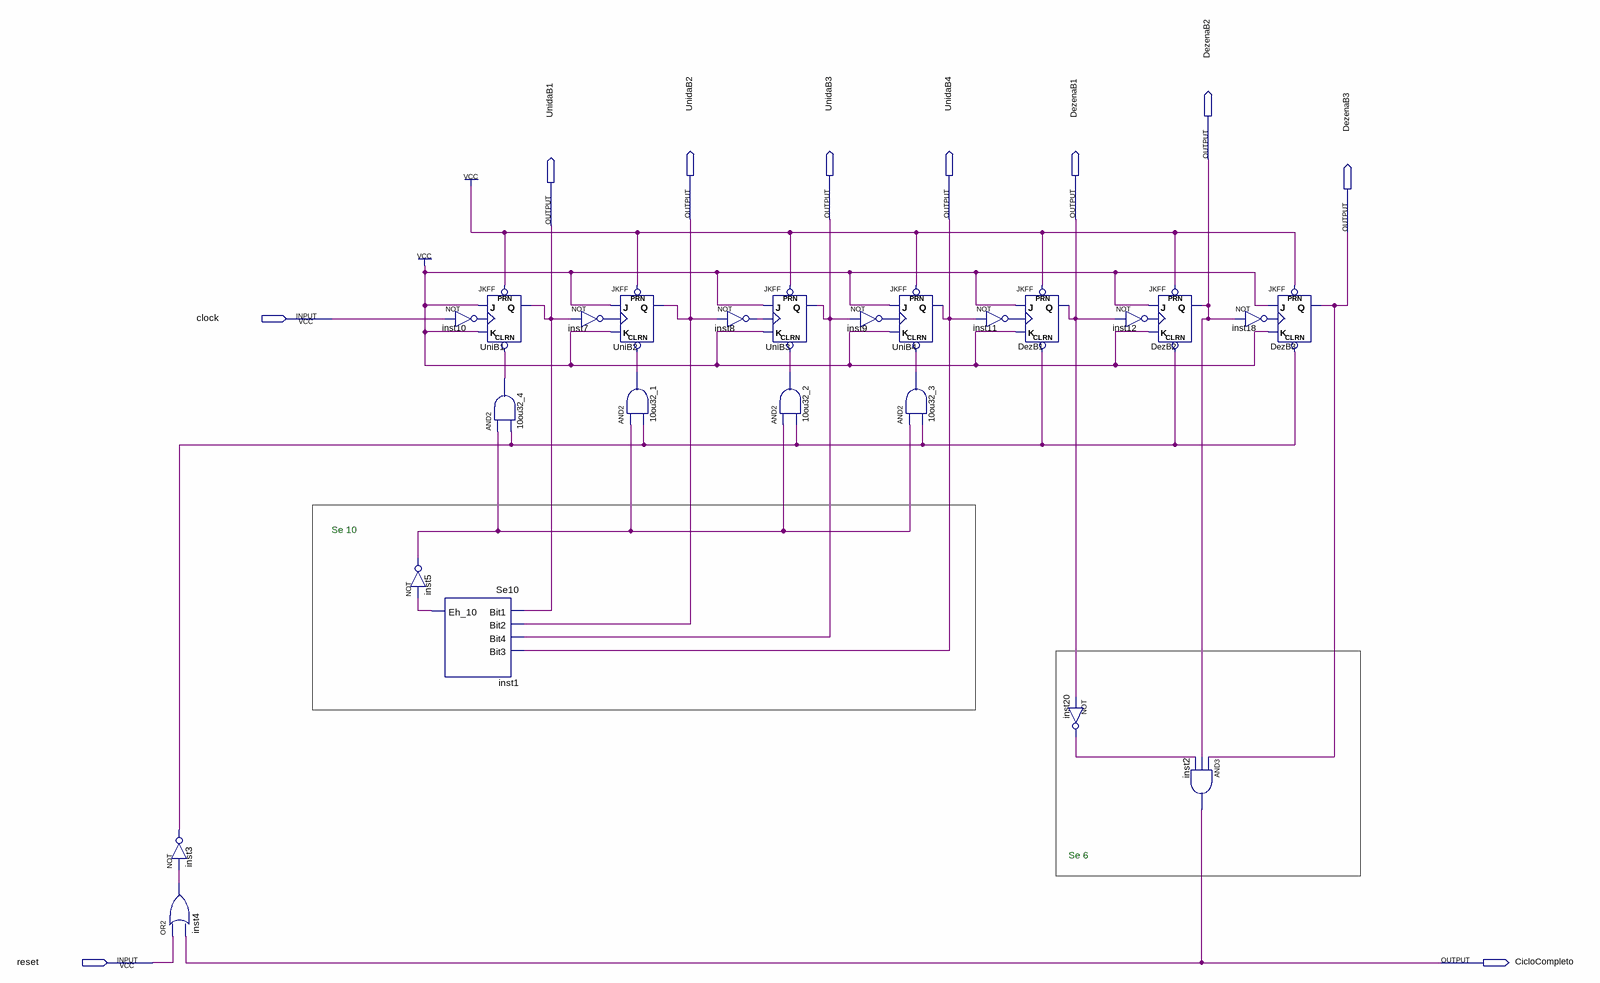
[diagram p0: schematic sheet]
// Quartus schematic Contador59.bdf as structural Verilog: 24 symbols, 10 pins
module Contador59 (
  input  clock,
  input  reset,
  output DezenaB2,
  output UnidaB2,
  output UnidaB3,
  output UnidaB4,
  output DezenaB1,
  output UnidaB1,
  output DezenaB3,
  output CicloCompleto
);

  wire inst1_eh_10, inst3_out, inst4_out, inst5_out, inst7_out, inst8_out, inst9_out, inst11_out, inst18_out,
       inst20_out, n10ou32_1_out, n10ou32_2_out, n10ou32_3_out, n10ou32_4_out;

  or inst4 (inst4_out, reset, CicloCompleto);
  not inst3 (inst3_out, inst4_out);
  not inst5 (inst5_out, inst1_eh_10);
  JKFF UniB1 (.PRN(1'b1), .CLRN(n10ou32_4_out), .K(1'b1), .J(1'b1), .Q(UnidaB1));  // open: CLK
  // NOT inst10 has open pins: IN=clock, OUT=open
  Se10 inst1 (.Bit1(UnidaB1), .Bit2(UnidaB2), .Bit4(UnidaB3), .Bit3(UnidaB4), .Eh_10(inst1_eh_10));
  and u_10ou32_4 (n10ou32_4_out, inst5_out, inst3_out);
  not inst7 (inst7_out, UnidaB1);
  JKFF UniB2 (.PRN(1'b1), .CLRN(n10ou32_1_out), .K(1'b1), .J(1'b1), .CLK(inst7_out), .Q(UnidaB2));
  and u_10ou32_1 (n10ou32_1_out, inst5_out, inst3_out);
  not inst8 (inst8_out, UnidaB2);
  JKFF UniB3 (.PRN(1'b1), .CLRN(n10ou32_2_out), .K(1'b1), .J(1'b1), .CLK(inst8_out), .Q(UnidaB3));
  and u_10ou32_2 (n10ou32_2_out, inst5_out, inst3_out);
  not inst9 (inst9_out, UnidaB3);
  JKFF UniB4 (.PRN(1'b1), .CLRN(n10ou32_3_out), .K(1'b1), .J(1'b1), .CLK(inst9_out), .Q(UnidaB4));
  and u_10ou32_3 (n10ou32_3_out, inst5_out, inst3_out);
  not inst11 (inst11_out, UnidaB4);
  JKFF DezB1 (.PRN(1'b1), .CLRN(inst3_out), .K(1'b1), .J(1'b1), .CLK(inst11_out), .Q(DezenaB1));
  not inst20 (inst20_out, DezenaB1);
  // NOT inst12 has open pins: IN=DezenaB1, OUT=open
  JKFF DezB2 (.PRN(1'b1), .CLRN(inst3_out), .K(1'b1), .J(1'b1), .Q(DezenaB2));  // open: CLK
  and inst2 (CicloCompleto, DezenaB3, DezenaB2, inst20_out);
  JKFF DezB3 (.PRN(1'b1), .CLRN(inst3_out), .K(1'b1), .J(1'b1), .CLK(inst18_out), .Q(DezenaB3));
  not inst18 (inst18_out, DezenaB2);

  // Notes on the sheet:
  //   Se 10
  //   Se 6
endmodule
